# EasyEDA schematic 1-Schematic_PCB_Quadcopter Mugiwara Pirate.json
TITLE: Quadcopter ESP32; REV: 1.0; Date: 2023-09-06; Sheet: 1/1; Drawn By: Mugiwara Pirates; Company: Universitas Negeri Yogyakarta
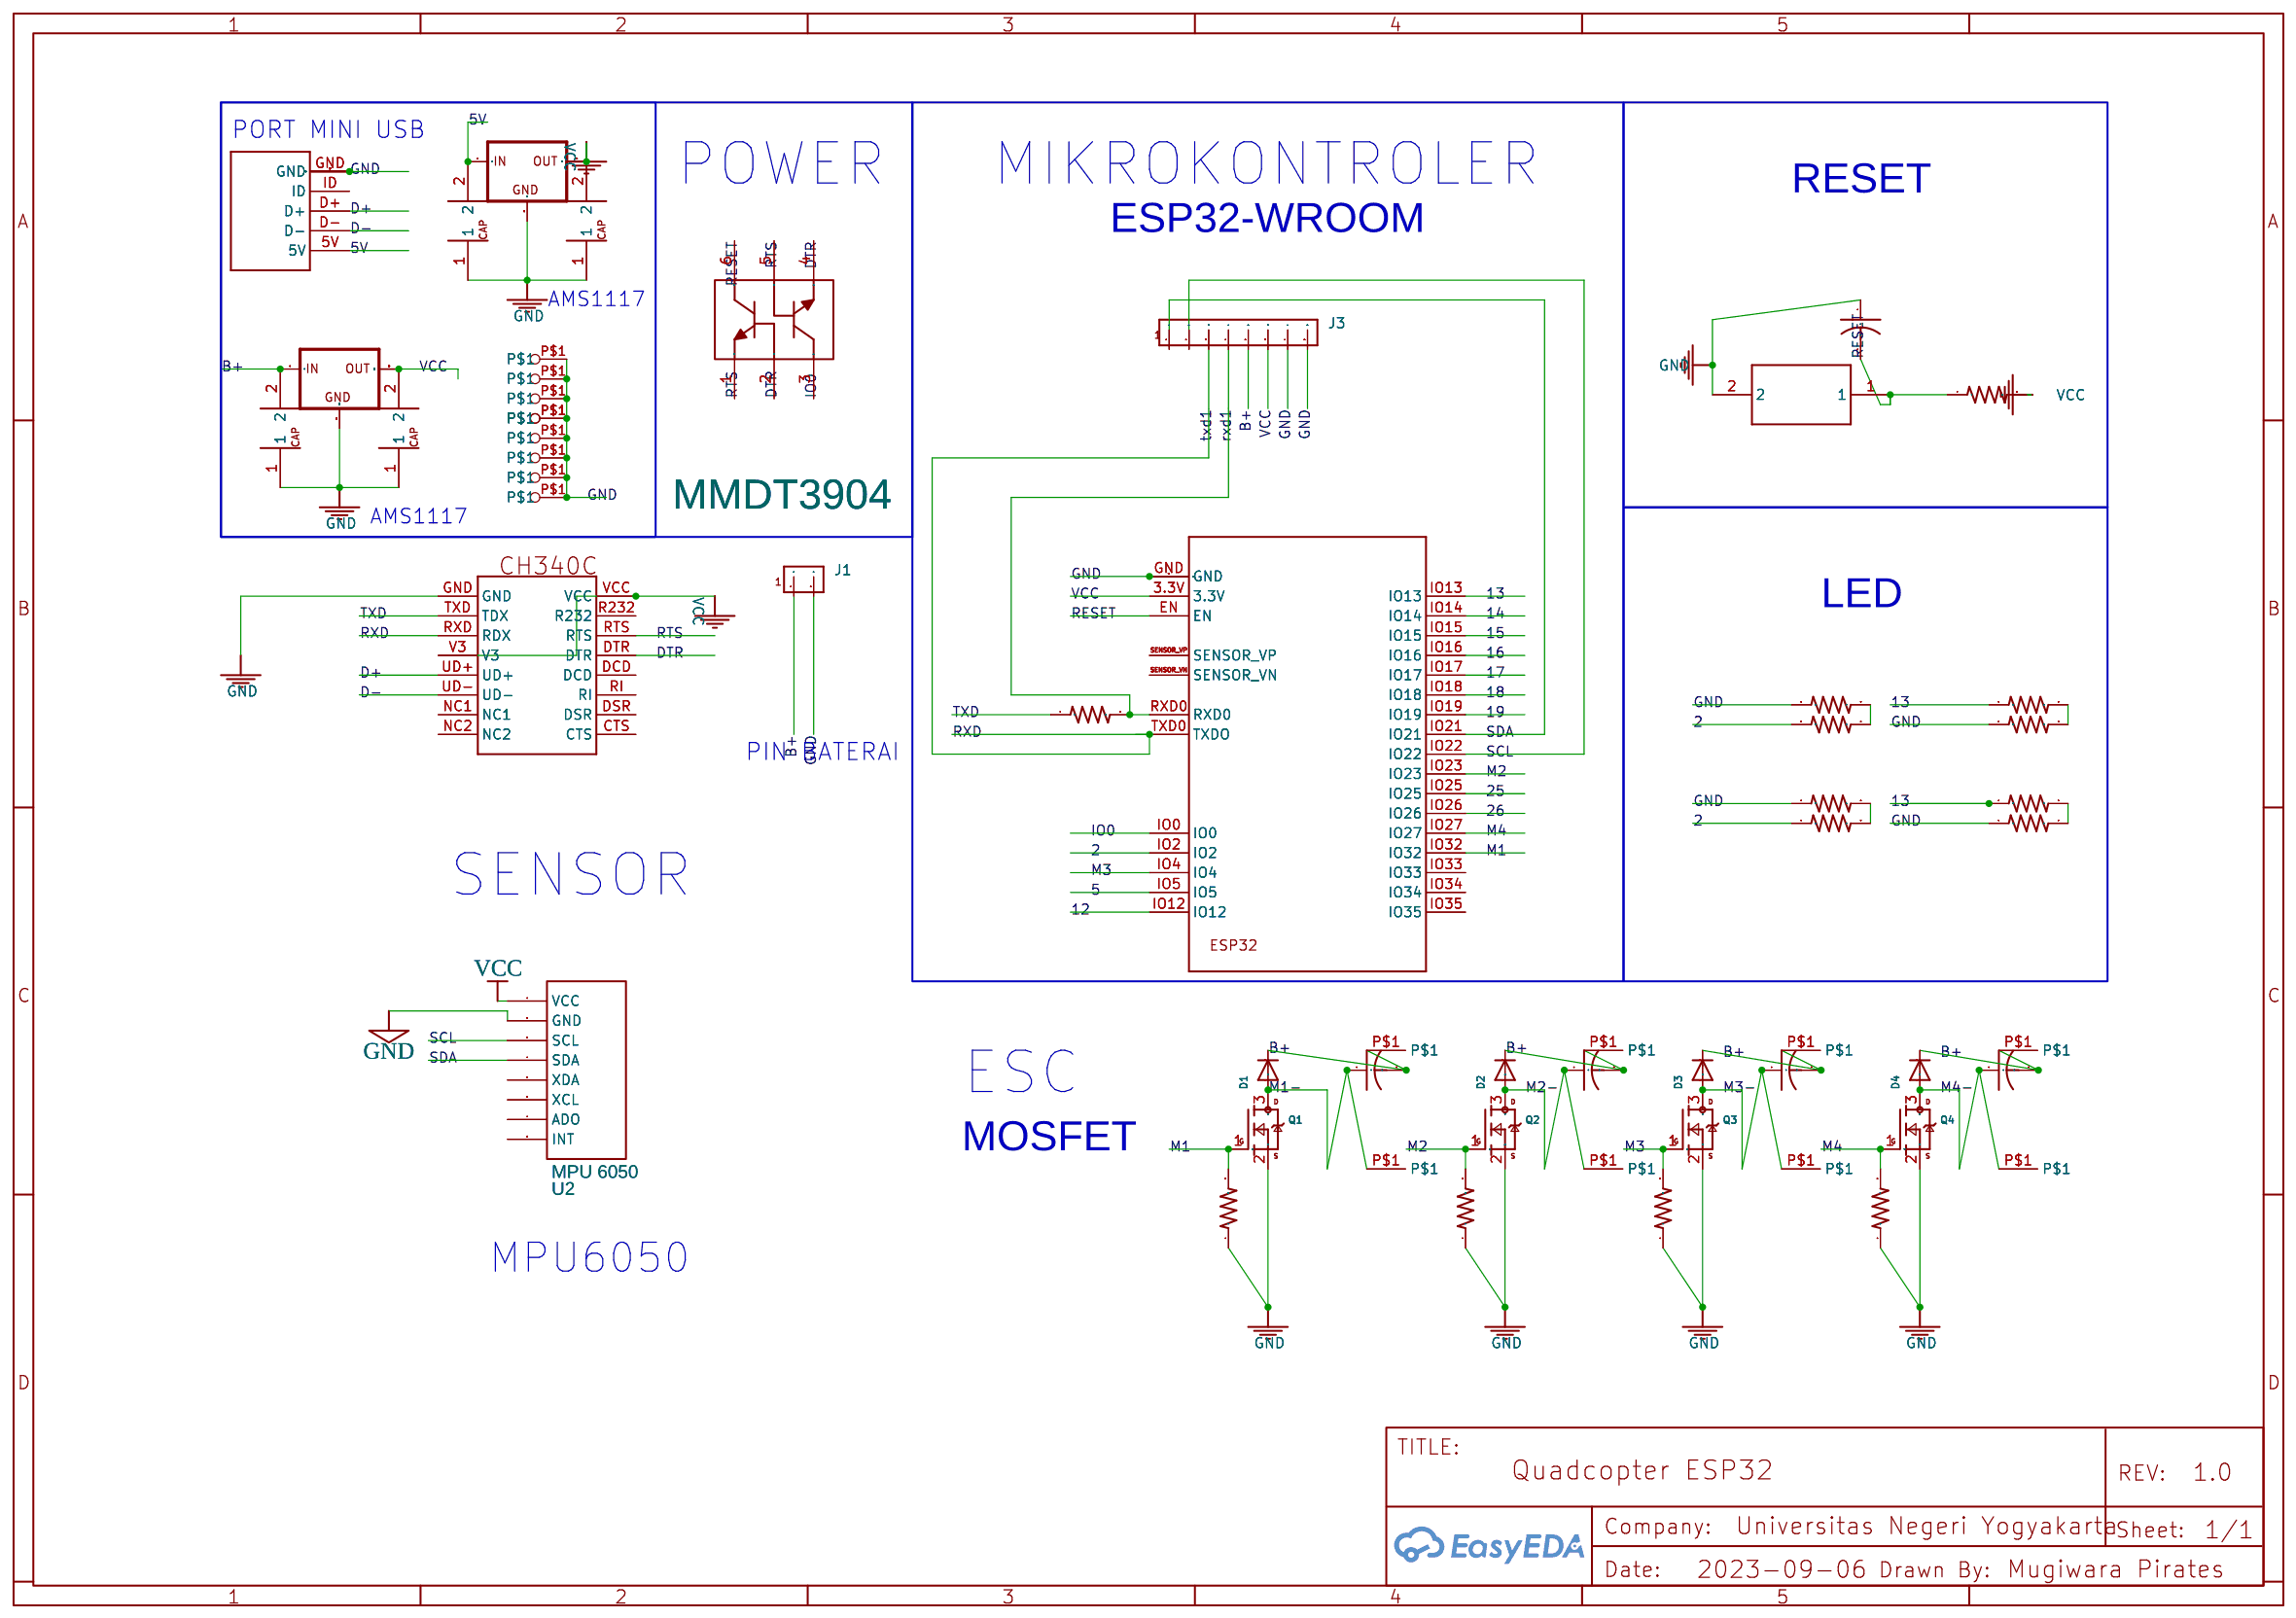
[diagram p0: schematic sheet]

## Parts
D1  DIODESOD-323F  [SOD-323F]
D2  DIODESOD-323F  [SOD-323F]
D3  DIODESOD-323F  [SOD-323F]
D4  DIODESOD-323F  [SOD-323F]
IC2  SELF_VREGMP3.3  [SOT223]
IC3  SELF_VREGMP3.3  [SOT223]
J1  MTA02-100  [10X02MTA]
J3  MTA08-100  [10X08MTA]
Q1  MOSFET-NREFLOW  [SOT23]
Q2  MOSFET-NREFLOW  [SOT23]
Q3  MOSFET-NREFLOW  [SOT23]
Q4  MOSFET-NREFLOW  [SOT23]
U1  ESP32  [MODULE_ESP-WROOM-32]
U2  MPU 6050  [MPU6050]
U3  MMDT3904  [SOT-363-6_L2.2-W1.3-P0.65-LS2.1-BL]
U$1  MICROUSB  [USB]
U$2  CH340C  [SOIC16]
U$13  SELF_CAP_0603SELF_CAP_0805  [SELF_CAP_0805]
U$14  SELF_CAP_0603SELF_CAP_0805  [SELF_CAP_0805]
U$16  R-US_R0603  [R0603]
U$18  SELF_CAP_0603SELF_CAP_0805  [SELF_CAP_0805]
U$19  SELF_CAP_0603SELF_CAP_0805  [SELF_CAP_0805]
U$20  R-US_R0603  [R0603]
U$21  R-US_R0603  [R0603]
U$22  R-US_R0603  [R0603]
U$23  R-US_R0603  [R0603]
U$24  C-USC0603  [C0603]
U$25  C-USC0603  [C0603]
U$26  C-USC0603  [C0603]
U$27  C-USC0603  [C0603]
U$29  SELF_PUSHBUTTON  [SELF_PUSHBUTTON]
U$30  R-US_R0603  [R0603]
U$31  C-USC0603  [C0603]
U$32  R-US_R0603  [R0603]
U$33  R-US_R0603  [R0603]
U$34  R-US_R0603  [R0603]
U$35  R-US_R0603  [R0603]
U$36  R-US_R0603  [R0603]
U$37  R-US_R0603  [R0603]
U$38  R-US_R0603  [R0603]
U$39  R-US_R0603  [R0603]
U$40  SELF_PINOUTS  [PINOUTS]
U$41  SELF_PINOUTS  [PINOUTS]
U$42  SELF_PINOUTS  [PINOUTS]
U$43  SELF_PINOUTS  [PINOUTS]
U$44  SELF_PINOUTS  [PINOUTS]
U$45  SELF_PINOUTS  [PINOUTS]
U$46  SELF_PINOUTS  [PINOUTS]
U$47  SELF_PINOUTS  [PINOUTS]
U$48  SELF_PIN2  [PIN2]
U$49  SELF_PIN2  [PIN2]
U$50  SELF_PIN2  [PIN2]
U$51  SELF_PIN2  [PIN2]
U$52  SELF_PIN2  [PIN2]
U$53  SELF_PIN2  [PIN2]
U$54  SELF_PIN2  [PIN2]
U$55  SELF_PIN2  [PIN2]
U$56  SELF_PIN2  [PIN2]

## Library data of the parts
J3 = -: Package Display: No
U2 = MPU 6050: Contributor: youssefbenabbou7
U3 = MMDT3904Q-7-F: Contributor: lcsc; Supplier: LCSC; Supplier Part: C5249110; Manufacturer: DIODES(美台); link: https://lcsc.com/eda_search?q=C5249110&%26type=1&ref=editor

## Nets
5V: IC2.VIN(IN) U$1.5V U$13.2
GND: IC2.GND IC3.GND J1.2 J3.7 J3.8 Q1.2(S) Q2.2(S) Q3.2(S) Q4.2(S) U1.GND U1.GND1(GND) U1.GND2(GND) U1.GND3(GND) U2.2(GND) U$1.GND U$1.GND1(GND) U$1.GND2(GND) U$1.GND3(GND) U$1.GND4(GND) U$1.GND5(GND) U$1.GND6(GND) U$2.GND U$13.1 U$14.1 U$18.1 U$19.1 U$20.1 U$21.1 U$22.1 U$23.1 U$29.2 U$31.1 U$32.1 U$35.1 U$37.1 U$38.1 U$48.P$1 U$49.P$1 U$50.P$1 U$51.P$1 U$52.P$1 U$53.P$1 U$54.P$1 U$55.P$1 U$56.P$1
VCC: IC2.VOUT(OUT) IC2.VOUT1(OUT) IC3.VOUT(OUT) IC3.VOUT1(OUT) J3.6 U1.3.3V U2.1(VCC) U$2.V3 U$2.VCC U$14.2 U$18.2 U$30.2
2: U1.IO2 U$33.1 U$39.1
5: U1.IO5
12: U1.IO12
13: U1.IO13 U$34.1 U$36.1
14: U1.IO14
15: U1.IO15
16: U1.IO16
17: U1.IO17
18: U1.IO18
19: U1.IO19
25: U1.IO25
26: U1.IO26
B+: D1.C D2.C IC3.VIN(IN) J1.1 J3.5 U$19.2 U$24.2 U$26.2 U$40.P$1 U$42.P$1
D+: U$1.D+ U$2.UD+
D-: U$1.D- U$2.UD-
DTR: U3.2(B2) U3.4(E1) U$2.DTR
IO0: U1.IO0 U3.3(C1)
M1: Q1.1(G) U1.IO32 U$20.2
M1-: D1.A Q1.3(D) U$24.1 U$41.P$1
M2: Q2.1(G) U1.IO23 U$21.2
M2-: D2.A Q2.3(D) U$26.1 U$43.P$1
M3: Q3.1(G) U1.IO4 U$22.2
M3-: D3.A Q3.3(D) U$27.1 U$45.P$1
M4: Q4.1(G) U1.IO27 U$23.2
M4-: D4.A Q4.3(D) U$25.1 U$47.P$1
RESET: U1.EN U3.6(C2) U$29.1 U$30.1 U$31.2
RTS: U3.1(E2) U3.5(B1) U$2.RTS
RXD: J3.3 U1.TXD0(TXDO) U$2.RXD(RDX)
rxd1: J3.4 U1.RXD0 U$16.2
SCL: J3.2 U1.IO22 U2.3(SCL)
SDA: J3.1 U1.IO21 U2.4(SDA)
TXD: U$2.TXD(TDX) U$16.1
Net-(D3-C): D3.C U$27.2 U$44.P$1
Net-(D4-C): D4.C U$25.2 U$46.P$1
Net-(U$32-2): U$32.2 U$33.2
Net-(U$34-2): U$34.2 U$35.2
Net-(U$36-2): U$36.2 U$37.2
Net-(U$38-2): U$38.2 U$39.2

Not connected (* = marked no-connect by the designer): U1 IO33 IO34 IO35 SENSOR_VN SENSOR_VP; U2 5(XDA) 6(XCL) 7(ADO) 8(INT); U$1 ID; U$2 CTS DCD DSR NC1 NC2 R232 RI

## Notes on the sheet
- PORT MINI USB
- POWER
- MIKROKONTROLER
- RESET
- ESP32-WROOM
- AMS1117
- AMS1117
- LED
- PIN BATERAI
- SENSOR
- ESC
- MOSFET
- MPU6050
